# Altium schematic sheet LED Chaser.SchDoc
size A; SheetNumber: 1; SheetTotal: 1
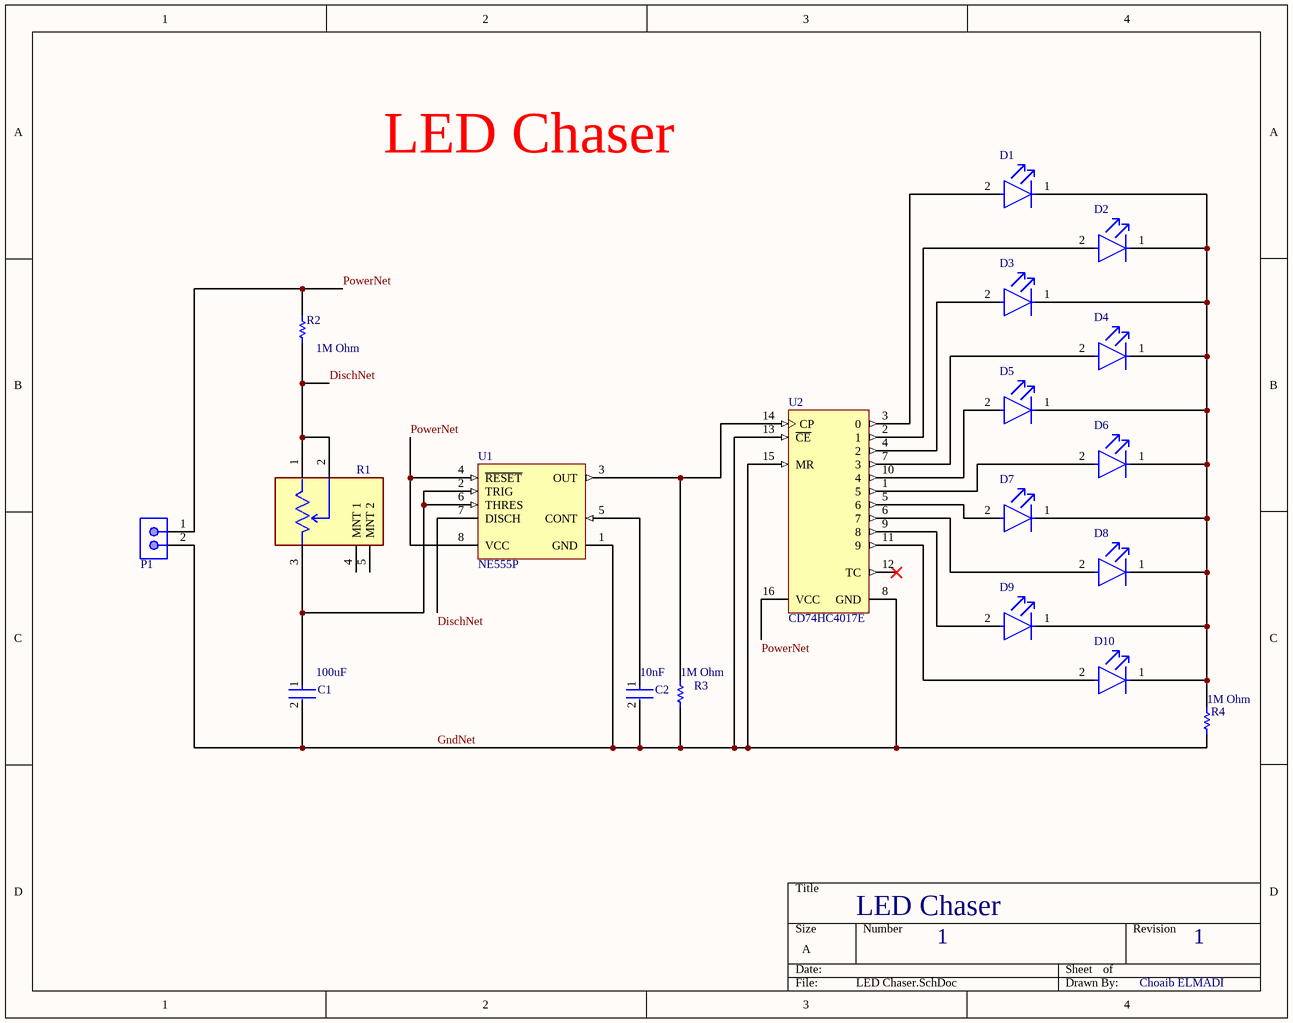
[diagram p0: LED Chaser.SchDoc]

## Parts
C1  Capacitance: 100uF  [FP-GRM32-0_3-MFG]  (hidden comment: GRM32ER60J107ME20L)
C2  Capacitance: 10nF  [FP-GRM32-0_3-MFG]  (hidden comment: GRM32ER60J107ME20L)
D1  TLHR4400  [FP-6_544-5255_01-4-MFG]  (value not drawn)
D2  TLHR4400  [FP-6_544-5255_01-4-MFG]  (value not drawn)
D3  TLHR4400  [FP-6_544-5255_01-4-MFG]  (value not drawn)
D4  TLHR4400  [FP-6_544-5255_01-4-MFG]  (value not drawn)
D5  TLHR4400  [FP-6_544-5255_01-4-MFG]  (value not drawn)
D6  TLHR4400  [FP-6_544-5255_01-4-MFG]  (value not drawn)
D7  TLHR4400  [FP-6_544-5255_01-4-MFG]  (value not drawn)
D8  TLHR4400  [FP-6_544-5255_01-4-MFG]  (value not drawn)
D9  TLHR4400  [FP-6_544-5255_01-4-MFG]  (value not drawn)
D10  TLHR4400  [FP-6_544-5255_01-4-MFG]  (value not drawn)
P1  5-146280-2  [TECO-5-146280-2_V]  (value not drawn)
R1  PTV09A-4225F-B103  [FP-PTV09A-4-MFG]  (value not drawn)
R2  Resistance: 1M Ohm  [RESA60-630X240]  (hidden comment: MFR-25FBF52-1M)
R3  Resistance: 1M Ohm  [RESA60-630X240]  (hidden comment: MFR-25FBF52-1M)
R4  Resistance: 1M Ohm  [RESA60-630X240]  (hidden comment: MFR-25FBF52-1M)
U1  NE555P  [P0008A]
U2  CD74HC4017E  [N0016A]

## Nets
DischNet: R1.1 R1.2 R2.1 U1.7(DISCH)
GndNet: C1.2 C2.2 P1.2 R3.1 R4.1 U1.1(GND) U2.8(GND) U2.13(~{CE}) U2.15(MR)
PowerNet: P1.1 R2.2 U1.4(~{RESET}) U1.8(VCC) U2.16(VCC)
NetC1_1: C1.1 R1.3 U1.2(TRIG) U1.6(THRES)
NetC2_1: C2.1 U1.5(CONT)
NetD1_1: D1.1(C) D2.1(C) D3.1(C) D4.1(C) D5.1(C) D6.1(C) D7.1(C) D8.1(C) D9.1(C) D10.1(C) R4.2
NetD1_2: D1.2(A) U2.3(0)
NetD2_2: D2.2(A) U2.2(1)
NetD3_2: D3.2(A) U2.4(2)
NetD4_2: D4.2(A) U2.7(3)
NetD5_2: D5.2(A) U2.10(4)
NetD6_2: D6.2(A) U2.1(5)
NetD7_2: D7.2(A) U2.5(6)
NetD8_2: D8.2(A) U2.6(7)
NetD9_2: D9.2(A) U2.9(8)
NetD10_2: D10.2(A) U2.11(9)
NetR3_2: R3.2 U1.3(OUT) U2.14(CP)

Not connected (* = marked no-connect by the designer): R1 4(MNT_1) 5(MNT_2); U2 12(TC)*

## Notes on the sheet
- LED Chaser
- 1
- Choaib ELMADI

## Library data of the parts
C1 C2 = CMP-2000-05259-2: CAP CER 100UF 6.3V X5R 1210; 3DS Part Number: 220-00002; Manufacturer: Murata; Temperature Coefficient: 15%; Material: Ceramic; Tolerance: 20%; Octopart: https://octopart.com/grm32er60j107me20l-murata-197007; ComponentLink2URL: https://search.murata.co.jp/Ceramy/image/img/A01X/G101/ENG/GRM32ER60J107ME20-01.pdf; Temperature Range High: +85°C; RoHS: TRUE; Device Class L3: Ceramic Capacitors; Manufacturer Part Number: GRM32ER60J107ME20L; Device Class L2: Capacitors; Voltage: 6.3V; Package: GRM32-0.3; Voltage Rating: 6.3V; Category: Cap; Device Class L1: Passive Components; Temperature Characteristic: X5R; Automotive: No; Digikey Description: CAP CER 100UF 6.3V X5R 1210; Temperature: -55°C to +85°C; Height: 2.7mm; Ipc Land Pattern Name: CAPC320250X250; Temperature Range Low: -55°C; Lead Free: Yes; Value: 100uF; ComponentLink2Description: Datasheet
D1-D10 = CMP-00030-55433986-1: TLHR4400 LED; Red; 3mcd; 3mmDia.; T-1; 30mA; 2V; 635nm; +/-30deg; GaAsP on GaP; 15V; 100mW; Viewing Angle: 30°; Lens Size: 3mm; Lens Style: Circular, Colored, Diffused, Dome, Round; Test Current: 10mA; Lens Transparency: Diffused; Dominant Wavelength: 625nm; Number of Elements: 1; NexarPartId: 55433986; Luminous Intensity: 3mcd; Mount: PCB, Through Hole; Packaging: Bulk; RoHS: Compliant; Number of Pins: 2; Diameter: 3mm; Forward Current: 10mA; Forward Voltage: 2V; Radiation Hardening: No; Min Operating Temperature: -40°C; Schedule B: 8541402000, 8541402000; Case/Package: T; Reverse Voltage: 15V; Wavelength: 625nm; REACH SVHC: Unknown; Max Operating Temperature: 100°C; Depth: 3.2mm; Length: 3.2mm; Illumination Color: Red; Height: 6.1mm; Color: Red; Power Dissipation: 100mW; Number of LEDs: 1
P1 = CMP-2000-07492-1: Male Header, Pitch 2.54 mm, 1 x 2 Position, Height 8.21 mm, Tail Length 3.05 mm, -65 to 105 degC, RoHS, Bulk; Manufacturer: TE Connectivity; Mating Connector Lock: No(Without); Number of Positions: 2; Pitch: 2.54mm; PCB Mounting Orientation: Vertical; Keyed: No; Case\/Package: 100; Mating Post Length: 0.23inch; High Temperature Housing: Yes; Max Current Rating: 5A; PCB Thickness: 0.063inch; PCB Mount Retention: Without; Approvals: CSA; Current Rating: 3A; Radiation Hardening: No; Length: 4.67mm; Contact Mating Length: 0.23inch; Connector Type: Header; Number of Rows: 1; Termination Post Length: 0.12inch; Board Standoff: No(Without); Max Operating Temperature: 105degC; Contact Shape: Square; Selectively Loaded: No(Without); Gasket: No(Without); Number of Contacts: 2; Contact Gender: Male; Mating Alignment: No(Without); Manufacturer URL: http://www.te.com/; Datasheet URL: http://www.te.com/commerce/DocumentDelivery/DDEController?Action=showdoc&DocId=Customer+Drawing%7F146280%7FH1%7Fpdf%7FEnglish%7FENG_CD_146280_H1.pdf%7F5-146280-2; Mount: ThroughHole; Orientation: Straight; Packaging: Carton; Package Reference: 5-146280-2; Package Quantity: 500; Stabilizers: No(Without); Row Spacing: 2.54mm; Contact Material: CopperAlloy; Panel Mount Retention: No(Without); Datasheet Version: Rev. H1, 08/2016; Housing Colour: Black; Colour: Black; Package Description: Male Header, Pitch 2.54 mm, 1 x 2 Position, Height 8.21 mm, Tail Length 3.05 mm; Contact Plating: Matte; Housing Material: Polymer; Contact Protection: No(Without); Min Operating Temperature: -65degC; Mounting Technology: ThroughHole; Flammability Rating: UL94V-0; RoHSCompliant: true; Termination: ThroughHole; Depth: 2.34mm; High Speed Serial Data Connector: No
R1 = CMP-07234-000052-1: POT 10K OHM 1/20W CARBON LINEAR; Power Rating: 50mW; Number of Gangs: 1; Hole Diameter: 9.1mm; Actuator Diameter: 0.236inch; Resistance Tolerance: 20%; Resistance: 10kR; Actuator Length: 0.984inch; Min Operating Temperature: -10°C; RoHS Compliant: Yes; Technology: CARBON FILM; Radiation Hardening: No; Taper: Linear; Military Standard: Not; Type: Potentiometer; Mount: Through Hole; Length: 11.4mm; Tolerance: 20%; Max Power Dissipation: 50mW; Max Operating Temperature: 50°C; Package Quantity: 100; Termination: PCB; Packaging: Bulk; Depth: 12.5mm; Resistor Type: Carbon; Number of Turns: 1; Series: Pro Audio PTV09; Height: 12.5mm; REACH SVHC: No SVHC
R2-R4 = CMP-1659-00070-1: Axial Resistor, 1 MOhm, +/- 1%, 250 mW, -55 to 155 degC, 2-Pin THD, RoHS, Bulk; Power Rating: 250 mW; Voltage Rating: 250 V; ComponentLink1Description: Manufacturer URL; PackageReference: MFR-25; ComponentLink2Description: Datasheet; ComponentLink2URL: http://www.yageo.com/documents/recent/Yageo%20LR_MFR_2013.pdf; Tolerance: 1%; DatasheetVersion: Apr-13; Package Quantity: 200; Packaging: Bulk; Case\Package: Axial; RoHSCompliant: true; ComponentLink1URL: http://www.yageo.com/; Length: 0.248 inch; Min Operating Temperature: -55 degC; Mount: Through Hole; PackageDescription: 2-Pin Axial Lead, Dia 2.4 mm, Body Length 6.3 mm; Max Operating Temperature: 155 degC
U1 = CMP-2000-04954-1: Precision Timer, 4.5 to 16 V, 0 to 70 degC, 8-Pin DIP, Pb-Free, Tube; Manufacturer: TexasInstruments; Maximum High Level Output Current: -200mA; Number of Internal Timers: 1; Operating Supply Voltage: 5; Maximum Low Level Output Current: 200mA; Rad Hard: No; Packaging: Rail/Tube; Manufacturer URL: http://www.ti.com/; Package Reference: P8; Package Description: 8-Pin Double In-line Package, Body 9.59 x 6.35 mm, Pitch 2.54 mm; Package URL: http://www.ti.com/lit/ml/mpdi001b/mpdi001b.pdf; Type: Standard; Datasheet URL: http://www.ti.com/general/docs/lit/getliterature.tsp?genericPartNumber=NE555&fileType=pdf; Category: Timer; Package: 8PDIP; Datasheet Version: Rev. I, 09/2014
U2 = CMP-1623-00548-2: High Speed CMOS Logic Decade Counter/Divider with 10 Decoded Outputs, N0016A, TUBE; Manufacturer: Texas Instruments; tpd @ Nom Voltage(Max)(ns): 54; Inputs: 1; Input Type: LVTTL/CMOS; Voltage(Nom)(V): 3.3,5; Schmitt Trigger: No; Output Drive (IOL/IOH)(Max)(mA): 5.2/-5.2; Bits(#): 10; VCC(Max)(V): 6; Technology Family: HC; ICC @ Nom Voltage(Max)(mA): 0.08; Rating: Catalog; F @ Nom Voltage(Max)(Mhz): 28; VCC(Min)(V): 2; Generic Part Number: CD74HC4017; Code_JEDEC: MS-001; DatasheetVersion: SCHS200D; Output Type: CMOS; Type: Decade; Operating Temperature Range(C): -55 to 125; PackageReference: N0016A; Function: Counter